# EAGLE design LedOrgan (EAGLE 7.7.0)
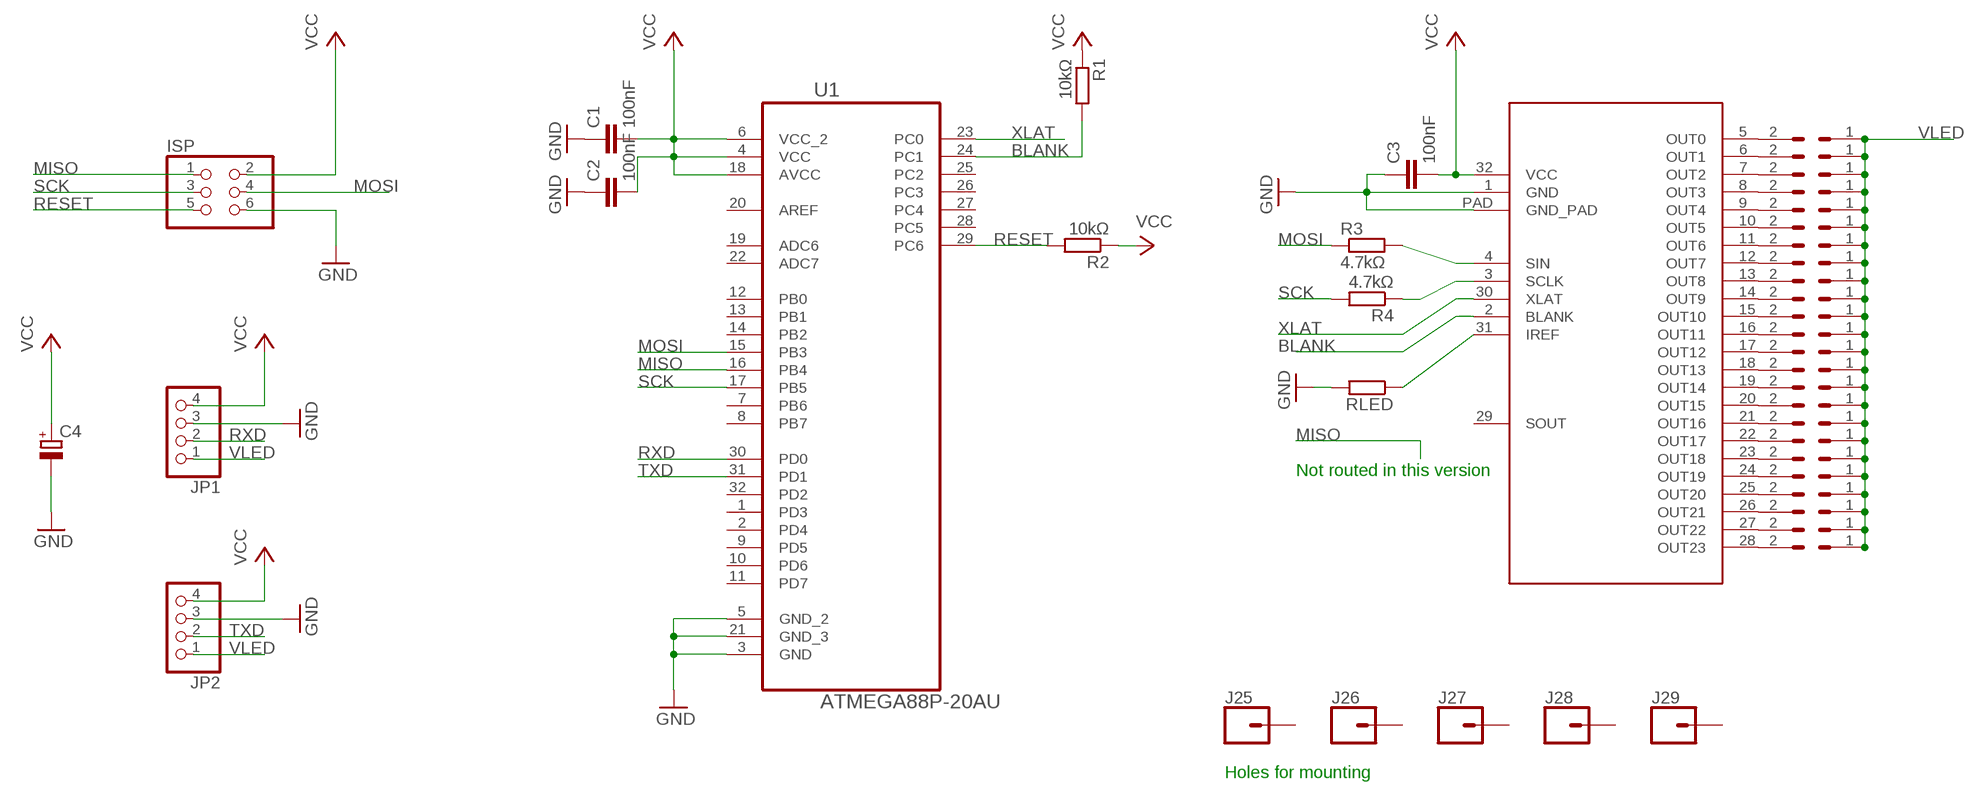
[diagram p0: schematic, sheet 1]

## Parts
C1  100nF  C-EUC0402  [C0402]
C2  100nF  C-EUC0402  [C0402]
C3  100nF  C-EUC0402  [C0402]
C4  CPOL-EUE2.5-5  [E2,5-5]
ISP  PINHD-2X3  [2X03]
J1  CONN_021X02_NO_SILK  [1X02_NO_SILK]
J2  CONN_021X02_NO_SILK  [1X02_NO_SILK]
J3  CONN_021X02_NO_SILK  [1X02_NO_SILK]
J4  CONN_021X02_NO_SILK  [1X02_NO_SILK]
J5  CONN_021X02_NO_SILK  [1X02_NO_SILK]
J6  CONN_021X02_NO_SILK  [1X02_NO_SILK]
J7  CONN_021X02_NO_SILK  [1X02_NO_SILK]
J8  CONN_021X02_NO_SILK  [1X02_NO_SILK]
J9  CONN_021X02_NO_SILK  [1X02_NO_SILK]
J10  CONN_021X02_NO_SILK  [1X02_NO_SILK]
J11  CONN_021X02_NO_SILK  [1X02_NO_SILK]
J12  CONN_021X02_NO_SILK  [1X02_NO_SILK]
J13  CONN_021X02_NO_SILK  [1X02_NO_SILK]
J14  CONN_021X02_NO_SILK  [1X02_NO_SILK]
J15  CONN_021X02_NO_SILK  [1X02_NO_SILK]
J16  CONN_021X02_NO_SILK  [1X02_NO_SILK]
J17  CONN_021X02_NO_SILK  [1X02_NO_SILK]
J18  CONN_021X02_NO_SILK  [1X02_NO_SILK]
J19  CONN_021X02_NO_SILK  [1X02_NO_SILK]
J20  CONN_021X02_NO_SILK  [1X02_NO_SILK]
J21  CONN_021X02_NO_SILK  [1X02_NO_SILK]
J22  CONN_021X02_NO_SILK  [1X02_NO_SILK]
J23  CONN_021X02_NO_SILK  [1X02_NO_SILK]
J24  CONN_021X02_NO_SILK  [1X02_NO_SILK]
J25  CONN_01PTH_NO_SILK_YES_STOP  [1X01_NO_SILK]
J26  CONN_01PTH_NO_SILK_YES_STOP  [1X01_NO_SILK]
J27  CONN_01PTH_NO_SILK_YES_STOP  [1X01_NO_SILK]
J28  CONN_01PTH_NO_SILK_YES_STOP  [1X01_NO_SILK]
J29  CONN_01PTH_NO_SILK_YES_STOP  [1X01_NO_SILK]
JP1  PINHD-1X4  [1X04]
JP2  PINHD-1X4  [1X04]
R1  10kΩ  R-EU_M0805  [M0805]
R2  10kΩ  R-EU_M0805  [M0805]
R3  4.7kΩ  R-EU_R0402  [R0402]
R4  4.7kΩ  R-EU_R0402  [R0402]
RLED  R-EU_M0805  [M0805]
U1  ATMEGA88P-20AU  [QFP80P900X900X120-32N]
U$2  TLC5947  [TSSOP-32]

## Nets
BLANK: R1.2 U1.24(PC1) U$2.2(BLANK)
GND: C1.1 C2.1 C3.1 C4.- ISP.6 JP1.3 JP2.3 RLED.2 U1.3(GND) U1.5(GND_2) U1.21(GND_3) U$2.1(GND) U$2.PAD(GND_PAD)
MISO: ISP.1 U1.16(PB4)
MOSI: ISP.4 R3.1 U1.15(PB3)
N$1: RLED.1 U$2.31(IREF)
N$3: R4.1 U$2.3(SCLK)
N$4: R3.2 U$2.4(SIN)
N$5: J1.2 U$2.5(OUT0)
N$6: J2.2 U$2.6(OUT1)
N$9: J3.2 U$2.7(OUT2)
N$10: J4.2 U$2.8(OUT3)
N$11: J5.2 U$2.9(OUT4)
N$12: J6.2 U$2.10(OUT5)
N$13: J7.2 U$2.11(OUT6)
N$14: J8.2 U$2.12(OUT7)
N$15: J9.2 U$2.13(OUT8)
N$16: J10.2 U$2.14(OUT9)
N$17: J11.2 U$2.15(OUT10)
N$18: J12.2 U$2.16(OUT11)
N$19: J13.2 U$2.17(OUT12)
N$20: J14.2 U$2.18(OUT13)
N$21: J15.2 U$2.19(OUT14)
N$22: J16.2 U$2.20(OUT15)
N$23: J17.2 U$2.21(OUT16)
N$24: J18.2 U$2.22(OUT17)
N$25: J19.2 U$2.23(OUT18)
N$26: J20.2 U$2.24(OUT19)
N$27: J21.2 U$2.25(OUT20)
N$28: J22.2 U$2.26(OUT21)
N$29: J23.2 U$2.27(OUT22)
N$30: J24.2 U$2.28(OUT23)
RESET: ISP.5 R2.2 U1.29(PC6)
RXD: JP1.2 U1.30(PD0)
SCK: ISP.3 R4.2 U1.17(PB5)
TXD: JP2.2 U1.31(PD1)
VCC: C1.2 C2.2 C3.2 C4.+ ISP.2 JP1.4 JP2.4 R1.1 R2.1 U1.4(VCC) U1.6(VCC_2) U1.18(AVCC) U$2.32(VCC)
VLED: J1.1 J2.1 J3.1 J4.1 J5.1 J6.1 J7.1 J8.1 J9.1 J10.1 J11.1 J12.1 J13.1 J14.1 J15.1 J16.1 J17.1 J18.1 J19.1 J20.1 J21.1 J22.1 J23.1 J24.1 JP1.1 JP2.1
XLAT: U1.23(PC0) U$2.30(XLAT)
Unconnected: J25.1 J26.1 J27.1 J28.1 J29.1 U1.1(PD3) U1.2(PD4) U1.7(PB6) U1.8(PB7) U1.9(PD5) U1.10(PD6) U1.11(PD7) U1.12(PB0) U1.13(PB1) U1.14(PB2) U1.19(ADC6) U1.20(AREF) U1.22(ADC7) U1.25(PC2) U1.26(PC3) U1.27(PC4) U1.28(PC5) U1.32(PD2) U$2.29(SOUT)

## Notes on the sheet
- Not routed in this version
- Holes for mounting

## Library data of the parts
C1-C3 = rcl:C-EU: CAPACITOR, European symbol
C4 = rcl:CPOL-EU: POLARIZED CAPACITOR, European symbol
ISP = pinhead:PINHD-2X3: PIN HEADER
J1-J24 = SparkFun-Connectors:CONN_02: Multi connection point. Often used as Generic Header-pin footprint for 0.1 inch spaced/style header connections On any of the 0.1 inch spaced packages, you can populate with these: Break Away Headers - Straight <https://www.sparkfun.com/products/116> (PRT-00116) Break Away Male Headers - Right Angle <https://www.sparkfun.com/products/553> (PRT-00553) Female Headers <https://www.sparkfun.com/products/115> (PRT-00115) Break Away Headers - Machine Pin <https://www.sparkfun.com/products/117> (PRT-00117) Break Away Female Headers - Swiss Machine Pin <https://www.sparkfun.com/products/743> (PRT-00743) For SCREWTERMINALS and SPRING TERMINALS visit here: Screw Terimnals on SparkFun.com <https://www.sparkfun.com/search/results?term=Screw+Terminals> (5mm/3.5mm/2.54mm spacing) This device is also useful as a general connection point to wire up your design to another part of your project. Our various solder wires solder well into these plated through hole pads. Hook-Up Wire - Assortment (Stranded, 22 AWG) <https://www.sparkfun.com/products/11375> (PRT-11375) Hook-Up Wire - Assortment (Solid Core, 22 AWG) <https://www.sparkfun.com/products/11367> (PRT-11367) View the entire wire category on our website here <https://www.sparkfun.com/categories/141> Special notes: Molex polarized connector foot print use with: PRT-08233 with associated crimp pins and housings. 2.54_SCREWTERM for use with PRT-10571. 3.5mm Screw Terminal footprints for PRT-08084 5mm Screw Terminal footprints for use with PRT-08432
J25-J29 = SparkFun-Connectors:CONN_01: Single connection point. Often used as Generic Header-pin footprint for 0.1 inch spaced/style header connections On any of the 0.1 inch spaced packages, you can populate with these: Break Away Headers - Straight <https://www.sparkfun.com/products/116> (PRT-00116) Break Away Male Headers - Right Angle <https://www.sparkfun.com/products/553> (PRT-00553) Female Headers <https://www.sparkfun.com/products/115> (PRT-00115) Break Away Headers - Machine Pin <https://www.sparkfun.com/products/117> (PRT-00117) Break Away Female Headers - Swiss Machine Pin <https://www.sparkfun.com/products/743> (PRT-00743) This device is also useful as a general connection point to wire up your design to another part of your project. Our various solder wires solder well into these plated through hole pads. Hook-Up Wire - Assortment (Stranded, 22 AWG) <https://www.sparkfun.com/products/11375> (PRT-11375) Hook-Up Wire - Assortment (Solid Core, 22 AWG) <https://www.sparkfun.com/products/11367> (PRT-11367) View the entire wire category on our website here <https://www.sparkfun.com/categories/141> Special notes: SMTSO-256-ET is a "flush mount" nut for a 4-40 screw. We mostly use this on specialty testbeds; it is a nice way to connect hardware to your PCB at an adjustable hieght. Also note, the SNAP packages are for using a snappable style connector. We sell a baggie of snaps and they are also used on two LilyPad designs: Snap Assortment - 30 pack (male and female) <https://www.sparkfun.com/products/11347> (DEV-11347) LilyPad Arduino SimpleSnap <https://www.sparkfun.com/products/10941> (DEV-10941) LilyPad SimpleSnap Protoboard <https://www.sparkfun.com/products/10940> (DEV-10940)
JP1 JP2 = pinhead:PINHD-1X4: PIN HEADER
R1-R4 RLED = rcl:R-EU_: RESISTOR, European symbol
U1 = Atmel_By_element14_Batch_1-00:ATMEGA88P-20AU: 8-bit Microcontroller with 4/8/16/32K Bytes In-System Programmable Flash; MPN: ATMEGA88P-20AU; OC_FARNELL: 1636946; OC_NEWARK: 03P2032; PACKAGE: TQFP-32; SUPPLIER: ATMEL
U$2 = Strutz Electronic Industries:TLC5947

## Board
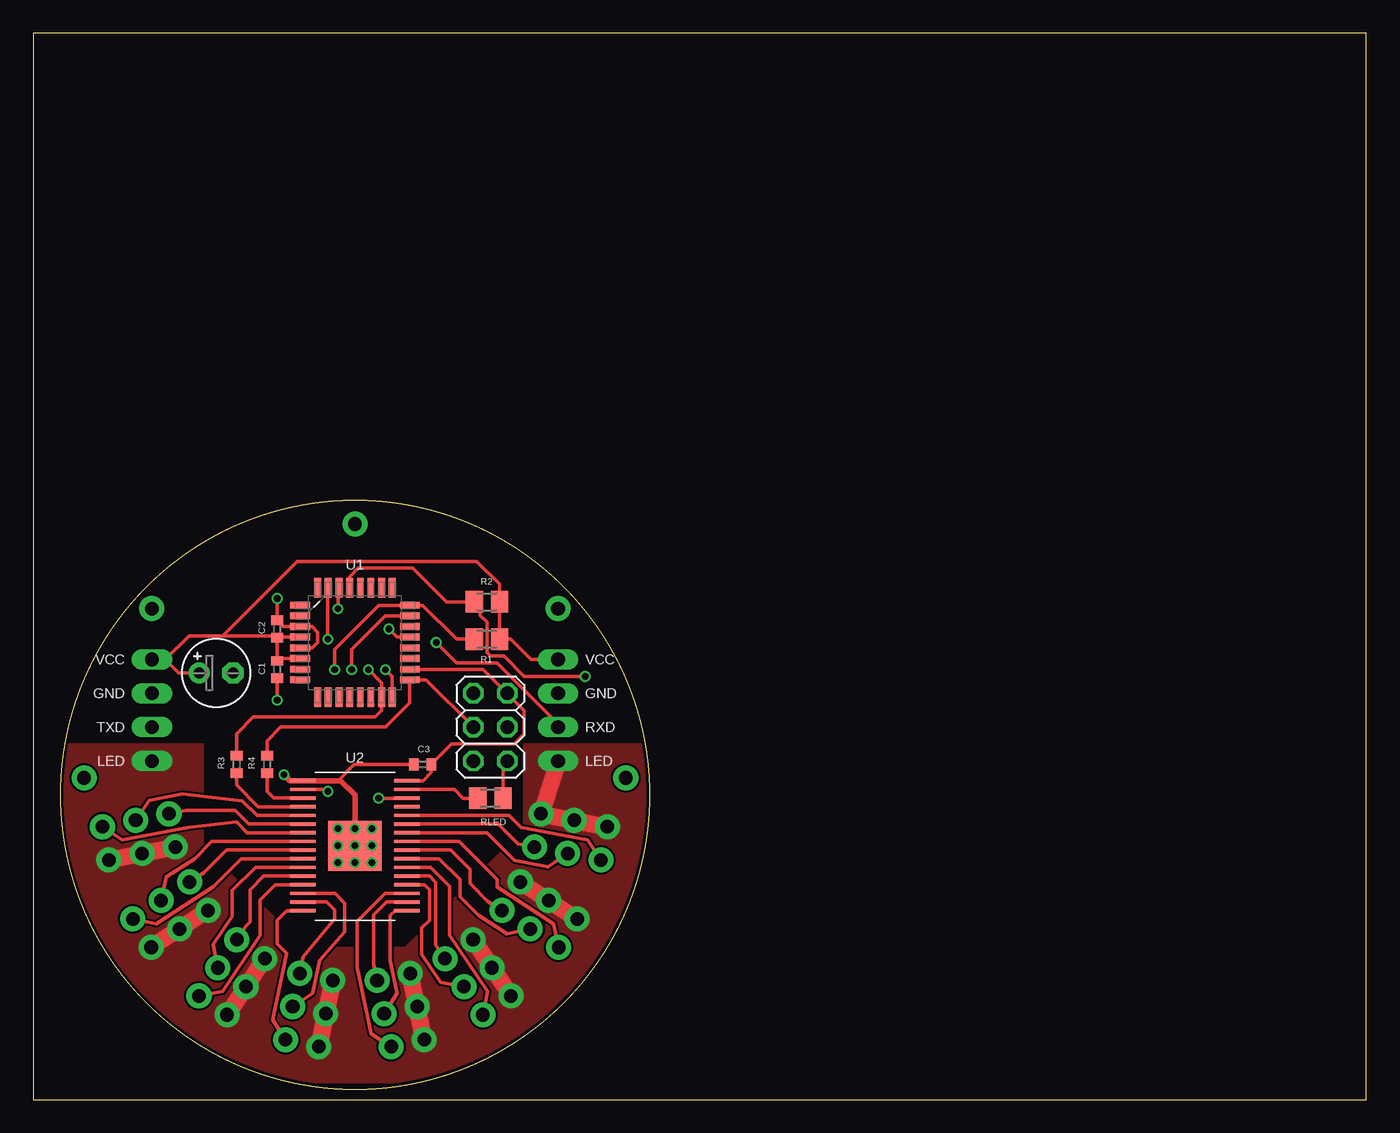
[diagram p1: board, top side]
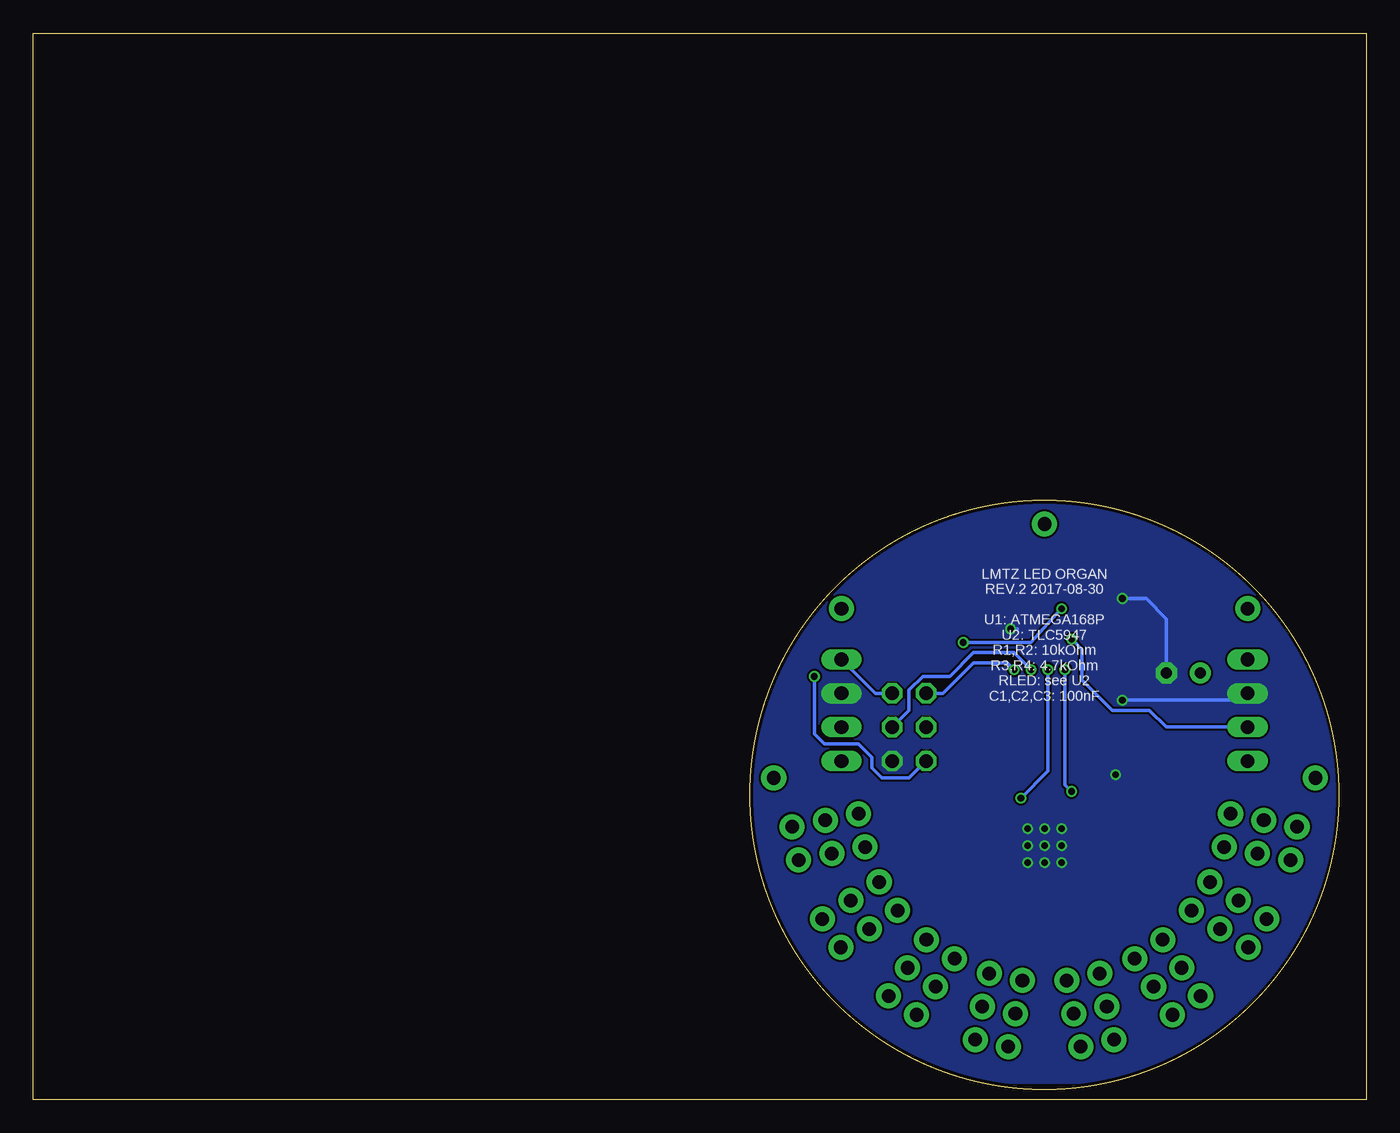
[diagram p2: board, bottom side, seen from below]

Size 100 x 80 mm. Coordinates in mm from the lower left corner, seen from the top.
Outline: 0,0 100,0 100,80 0,80 0,0
Outline: circle at 24.13,22.86 radius 22.1
Copper layers (1*16): Top 0.035mm / dielectric 1.5mm / Bottom 0.035mm
Design rules "SeeedStudio_2layer_DRU_no_angle_20140221": minimum track width 6mil, minimum drill 12mil, track to track 6mil, track to pad 6mil, pad to pad 6mil, via to via 6mil, smd to smd 0mil, copper to edge 10mil, drill to drill 10mil, minimum pad ring 10mil, minimum via ring 6mil, stop-mask expansion 2mil, vias tented up to drill 100mil, thermal gap 10mil

### Footprints (pad centres in the part's own frame; a part is rotated, then mirrored left to right if it is on the bottom)
C0402 = smd 0.7 x 0.9: 1 -0.65,0; 2 0.65,0
E2,5-5 = drill 0.813 pad 1.6: + -1.27,0 | drill 0.813 pad 1.6 octagon: - 1.27,0
2X03 = drill 1.016 octagon: 1 -2.54,-1.27; 2 -2.54,1.27; 3 0,-1.27; 4 0,1.27; 5 2.54,-1.27; 6 2.54,1.27
1X02_NO_SILK = drill 1.016 pad 1.88: 1 0,0; 2 2.54,0
1X01_NO_SILK = drill 1.016 pad 1.88: 1 0,0
1X04 = drill 1.016 long: 1 -3.81,0; 2 -1.27,0; 3 1.27,0; 4 3.81,0
M0805 = smd 1.3 x 1.6: 1 -0.95,0; 2 0.95,0
R0402 = smd 0.7 x 0.9: 1 -0.65,0; 2 0.65,0
QFP80P900X900X120-32N = smd 1.473 x 0.508: 1 -4.115,2.794; 2 -4.115,2.007; 3 -4.115,1.194; 4 -4.115,0.406; 5 -4.115,-0.406; 6 -4.115,-1.194; 7 -4.115,-2.007; 8 -4.115,-2.794; 17 4.115,-2.794; 18 4.115,-2.007; 19 4.115,-1.194; 20 4.115,-0.406; 21 4.115,0.406; 22 4.115,1.194; 23 4.115,2.007; 24 4.115,2.794 | smd 0.508 x 1.473: 9 -2.794,-4.115; 10 -2.007,-4.115; 11 -1.194,-4.115; 12 -0.406,-4.115; 13 0.406,-4.115; 14 1.194,-4.115; 15 2.007,-4.115; 16 2.794,-4.115; 25 2.794,4.115; 26 2.007,4.115; 27 1.194,4.115; 28 0.406,4.115; 29 -0.406,4.115; 30 -1.194,4.115; 31 -2.007,4.115; 32 -2.794,4.115
TSSOP-32 = smd 1.9 x 0.25: 1 -3.9,4.875; 2 -3.9,4.225; 3 -3.9,3.575; 4 -3.9,2.925; 5 -3.9,2.275; 6 -3.9,1.625; 7 -3.9,0.975; 8 -3.9,0.325; 9 -3.9,-0.325; 10 -3.9,-0.975; 11 -3.9,-1.625; 12 -3.9,-2.275; 13 -3.9,-2.925; 14 -3.9,-3.575; 15 -3.9,-4.225; 16 -3.9,-4.875; 17 3.9,-4.875; 18 3.9,-4.225; 19 3.9,-3.575; 20 3.9,-2.925; 21 3.9,-2.275; 22 3.9,-1.625; 23 3.9,-0.975; 24 3.9,-0.325; 25 3.9,0.325; 26 3.9,0.975; 27 3.9,1.625; 28 3.9,2.275; 29 3.9,2.925; 30 3.9,3.575; 31 3.9,4.225; 32 3.9,4.875 | smd 4 x 3.75: PAD 0,0

### Placement (x,y rotation side)
C1  18.29,32.26 90 top
C2  18.29,35.31 270 top
C3  29.21,25.15 0 top
C4  13.72,32 0 top
ISP  34.29,27.94 270 top
J1  8.17,18.46 101 top
J2  10.66,18.95 101 top
J3  5.67,17.98 101 top
J4  10.98,12.8 123 top
J5  13.11,14.19 123 top
J6  8.85,11.42 123 top
J7  15.95,8.46 146 top
J8  17.37,10.57 146 top
J9  14.53,6.36 146 top
J10  21.94,6.45 168 top
J11  22.47,8.93 168 top
J12  21.41,3.96 168 top
J13  28.8,6.97 192 top
J14  28.28,9.46 192 top
J15  29.33,4.49 192 top
J16  34.42,9.88 214 top
J17  32.99,11.99 214 top
J18  35.84,7.78 214 top
J19  38.67,14.93 237 top
J20  36.54,16.32 237 top
J21  40.8,13.55 237 top
J22  40.58,20.96 259 top
J23  38.09,21.44 259 top
J24  43.07,20.47 259 top
J25  3.81,24.13 0 top
J26  44.45,24.13 0 top
J27  8.89,36.83 0 top
J28  39.37,36.83 0 top
J29  24.13,43.18 0 top
JP1  39.37,29.21 90 top
JP2  8.89,29.21 90 top
R1  34.04,34.54 180 top
R2  34.04,37.34 180 top
R3  15.24,25.15 270 top
R4  17.53,25.15 90 top
RLED  34.29,22.61 0 top
U1  24.13,34.29 0 top
U$2  24.13,19.05 0 top

### Tracks (layer width: path | path; a pad name or v marks a point on that pad's centre or on a via)
BLANK  (via drill 0.5 pad 0.25)
  Top 0.254: 33.09,34.36 R1.2 31.75,34.54 29.21,37.08 U1.24 25.91,37.08 22.61,33.78 v22.61,32.26 | v22.1,23.11 21.94,23.27 U$2.2
  Bottom 0.254: v22.61,32.26 22.61,23.62 v22.1,23.11
GND  (via drill 0.5 pad 0.25)
  Top 0.254: C3.1 24.08,25.15 22.86,23.93 | RLED.2 35.24,25.08 ISP.6 | C1.1 v18.29,29.97 | v18.29,37.59 C2.1 18.76,35.48 U1.3 20.9,35.48 21.34,35.05 21.34,34.29 20.93,33.88 U1.5 | U1.21 27.28,34.7 v26.67,35.31
  Top 0.406: v18.8,24.38 19.25,23.93 U$2.1 22.86,23.93 23.07,23.93 24.13,22.86 v24.13,20.32 U$2.PAD
  Bottom 0.254: v18.29,29.97 9.4,29.97 JP2.3 | v18.29,37.59 16.51,37.59 14.99,36.07 C4.- | v26.67,35.31 26.16,35.31
  other vias: 24.13,19.05 22.86,20.32 22.86,19.05 22.86,17.78 24.13,17.78 25.4,17.78 25.4,19.05 25.4,20.32
  pour Bottom (rank 2, no thermals): 1.27,1.27 1.27,46.99 46.99,45.72 46.99,1.27
MISO  (via drill 0.5 pad 0.25)
  Top 0.254: v26.42,32.26 26.92,31.75 U1.16
  Bottom 0.254: ISP.1 31.75,30.48 29.46,32.77 26.92,32.77 v26.42,32.26
MOSI  (via drill 0.5 pad 0.25)
  Top 0.254: v25.15,32.26 26.14,31.27 U1.15 26.14,29.18 25.65,28.7 16.51,28.7 15.24,27.43 R3.1
  Bottom 0.254: ISP.4 34.29,29.21 34.29,30.73 33.27,31.75 31.24,31.75 29.46,33.53 26.42,33.53 v25.15,32.26
N$1
  Top 0.254: U$2.31 31.59,23.27 32.26,22.61 RLED.1
N$3
  Top 0.254: U$2.3 18.02,22.62 17.53,23.11 R4.1
N$4
  Top 0.254: U$2.4 16.89,21.98 15.24,23.62 R3.2
N$5
  Top 0.254: J1.2 8.69,22.45 11.18,22.93 15.68,22.42 16.77,21.32 U$2.5
N$6
  Top 0.254: J2.2 11.42,21.68 15.15,21.68 16.16,20.68 U$2.6
N$9
  Top 0.254: J3.2 6.68,19.47 11.66,20.44 15.24,20.83 16.04,20.02 U$2.7
N$10
  Top 0.254: J4.2 9.96,16.69 12.1,18.07 13.4,19.38 U$2.8
N$11
  Top 0.254: J5.2 12.79,17.01 14.5,18.73 U$2.9
N$12
  Top 0.254: J6.2 9.22,13.18 13.48,15.94 15.61,18.07 U$2.10
N$13
  Top 0.254: J7.2 13.5,11.65 14.92,13.75 14.92,15.68 16.66,17.43 U$2.11
N$14
  Top 0.254: J8.2 15.97,13.04 16.26,13.32 16.26,15.75 17.28,16.77 U$2.12
N$15
  Top 0.254: J9.2 14.19,8.12 17.03,12.33 17.03,15 18.16,16.12 U$2.13
N$16
  Top 0.254: J10.2 20.96,7.95 21.49,10.44 23.37,12.57 23.37,14.73 22.62,15.47 U$2.14
N$17
  Top 0.254: J11.2 20.25,10.7 22.61,13.57 22.61,14.22 22,14.82 U$2.15
N$18
  Top 0.254: J12.2 17.95,6 19,10.97 18.29,11.68 18.29,13.46 19,14.18 U$2.16
N$19
  Top 0.254: J13.2 27.3,7.95 26.77,10.44 26.77,13.82 27.13,14.18 U$2.17
N$20
  Top 0.254: J14.2 25.53,10.17 25.53,13.84 26.51,14.82 U$2.18
N$21
  Top 0.254: J15.2 25.34,4.94 24.29,9.91 24.29,13.36 26.4,15.47 U$2.19
N$22
  Top 0.254: J16.2 30.55,8.8 29.13,10.91 29.13,12.87 29.72,13.46 29.72,15.75 29.34,16.12 U$2.20
N$23
  Top 0.254: J17.2 30.18,11.62 30.18,16.3 29.72,16.76 28.04,16.76 U$2.21
N$24
  Top 0.254: J18.2 34.07,8.12 31.23,12.33 31.23,16.01 29.82,17.43 U$2.22
N$25
  Top 0.254: J19.2 35.53,12.43 33.4,13.81 32,15.21 32,16.51 30.44,18.07 U$2.23
N$26
  Top 0.254: J20.2 34.09,14.88 32.77,16.2 32.77,17.27 31.31,18.73 U$2.24
N$27
  Top 0.254: J21.2 39.04,13.18 34.78,15.94 34.78,16.53 31.93,19.38 U$2.25
N$28
  Top 0.254: J22.2 38.6,17.46 36.11,17.94 34.03,20.02 U$2.26
N$29
  Top 0.254: J23.2 36.35,19.19 34.87,20.68 U$2.27
N$30
  Top 0.254: J24.2 41.58,19.47 36.6,20.44 35.71,21.32 U$2.28
RESET  (via drill 0.5 pad 0.25)
  Top 0.254: 33.09,36.76 R2.2 | R2.2 33.02,37.4 33.02,37.34 30.99,37.34 28.45,39.88 24.38,39.88 23.72,39.22 U1.29 | v41.4,31.75 36.83,31.75 35.31,33.27 34.29,33.27 34.04,33.53 34.04,35.81 33.53,36.32 33.53,36.9 R2.2
  Bottom 0.254: ISP.5 34.29,24.13 36.32,24.13 37.08,24.89 37.08,25.65 38.1,26.67 40.64,26.67 41.4,27.43 v41.4,31.75
RXD  (via drill 0.5 pad 0.25)
  Top 0.254: JP1.2 39.37,28.19 34.8,32.77 31.75,32.77 v30.23,34.29 | v22.86,36.83 22.86,38.33 U1.30
  Bottom 0.254: v30.23,34.29 25.15,34.29 v22.86,36.83
SCK
  Top 0.254: ISP.3 29.46,31.5 U1.17 28.25,29.77 26.42,27.94 18.54,27.94 17.53,26.92 R4.2
TXD  (via drill 0.5 pad 0.25)
  Top 0.254: v22.1,34.54 22.1,38.38 U1.31
  Bottom 0.254: JP2.2 14.99,27.94 16.26,29.21 19.05,29.21 21.34,31.5 21.34,33.78 v22.1,34.54
VCC
  Top 0.254: U$2.32 29.26,23.93 29.86,24.53 C3.2 31.38,26.67 36.07,26.67 36.83,27.43 36.83,29.21 ISP.2 33.76,32.28 U1.18 | R1.1 35.05,34.54 34.99,34.61 | JP1.4 37.34,33.02 35.81,34.54 R1.1 | R1.1 34.99,34.61 | R2.1 34.99,37.27 35.05,37.34 | U1.6 18.48,33.1 C1.2 C2.2 | U1.4 18.33,34.7 C2.2 | JP2.4 9.91,33.02 | 9.91,33.02 11.68,34.8 14.22,34.8 | 14.22,34.8 18.15,34.8 C2.2 | 9.91,33.02 10.92,32 C4.+ | 14.22,34.8 19.81,40.39 33.27,40.39 34.99,38.67 R2.1 | 34.99,34.61 R2.1
  Bottom 0.254: JP1.4 36.83,30.48 ISP.2
VLED
  Top 1.27: JP1.1 J23.1 J22.1 J24.1 | J20.1 J19.1 J21.1 | J17.1 J16.1 J18.1 | J15.1 J13.1 J14.1 | J11.1 J10.1 J12.1 | J9.1 J7.1 J8.1 | J5.1 J4.1 J6.1 | J3.1 J1.1 J2.1
  pour Top (no thermals): 1.27,26.67 12.7,26.67 12.7,19.05 20.32,11.43 27.94,11.43 36.83,20.32 36.83,26.67 46.99,26.67 46.99,1.27 1.27,1.27
XLAT  (via drill 0.5 pad 0.25)
  Top 0.254: U1.23 26.39,36.3 23.88,33.78 v23.88,32.26 | v25.91,22.61 28.01,22.61 U$2.30
  Bottom 0.254: v23.88,32.26 23.88,24.64 v25.91,22.61

### Text on the board
tNames: U1 | VCC | VCC | GND | GND | TXD | RXD | U2 | LED | LED
bNames: LMTZ LED ORGAN / REV.2 2017-08-30 / / U1: ATMEGA168P / U2: TLC5947 / R1,R2: 10kOhm / R3,R4: 4.7kOhm / RLED: see U2 / C1,C2,C3: 100nF